# Altium project 5V_Board_Final.PrjPcb
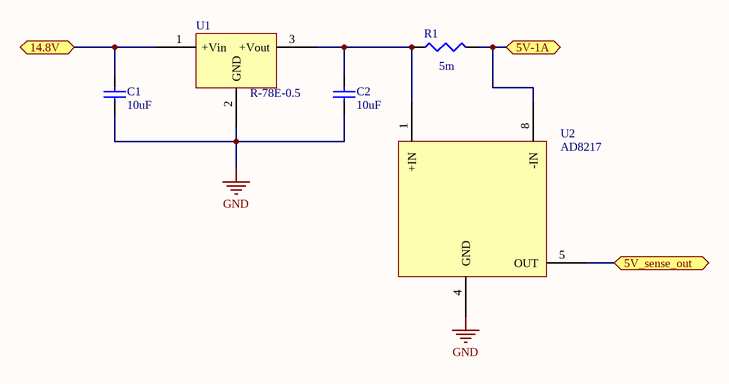
[diagram p0: 5V_Converter.SchDoc]
1 sheet, 5 parts. Net scope: flat (ports and power ports of the same name join across sheets).
Board file: 5V_Converter.PcbDoc

## Sheet 5V_Converter.SchDoc
size A

### Parts
C1  10uF  [C1206]
C2  10uF  [C1206]
R1  value 5m  [J1-0603]  (hidden comment: Res3)
U1  R-78E-0.5  [R-78E-0.5]
U2  AD8217  [AD8217]

### Ports
5V-1A, 5V_sense_out, 14.8V

### Nets
GND: C1.1 C2.1 U1.2(GND) U2.4(GND)
NetC1_2: C1.2 U1.1(+Vin) ; port 14.8V
NetC2_2: C2.2 R1.1 U1.3(+Vout) U2.1(+IN)
NetR1_2: R1.2 U2.8(-IN) ; port 5V-1A
NetU2_5: U2.5(OUT) ; port 5V_sense_out

### Library data of the parts
C1 C2 = Cap Semi: Capacitor (Semiconductor SIM Model); Published: 8-Jun-2000; LatestRevisionDate: 29-May-2009; LatestRevisionNote: IPC-7351 Footprint Added.; PackageReference: C1206; Publisher: Altium Limited; PackageDescription: Chip Capacitor; Value: 10uF
R1 = Res3: Resistor; Published: 8-Jun-2000; LatestRevisionDate: 29-May-2009; LatestRevisionNote: IPC-7351 Footprint Added.; PackageReference: J1-0603; Publisher: Altium Limited; PackageDescription: Chip Resistor
U1 = R-78E-0.5: DC/DC Converter
U2 = AD8217: Current Shunt Moniter